# EAGLE schematic attiniest85-batty-shield-mk-2.0 (EAGLE 6.5.0)
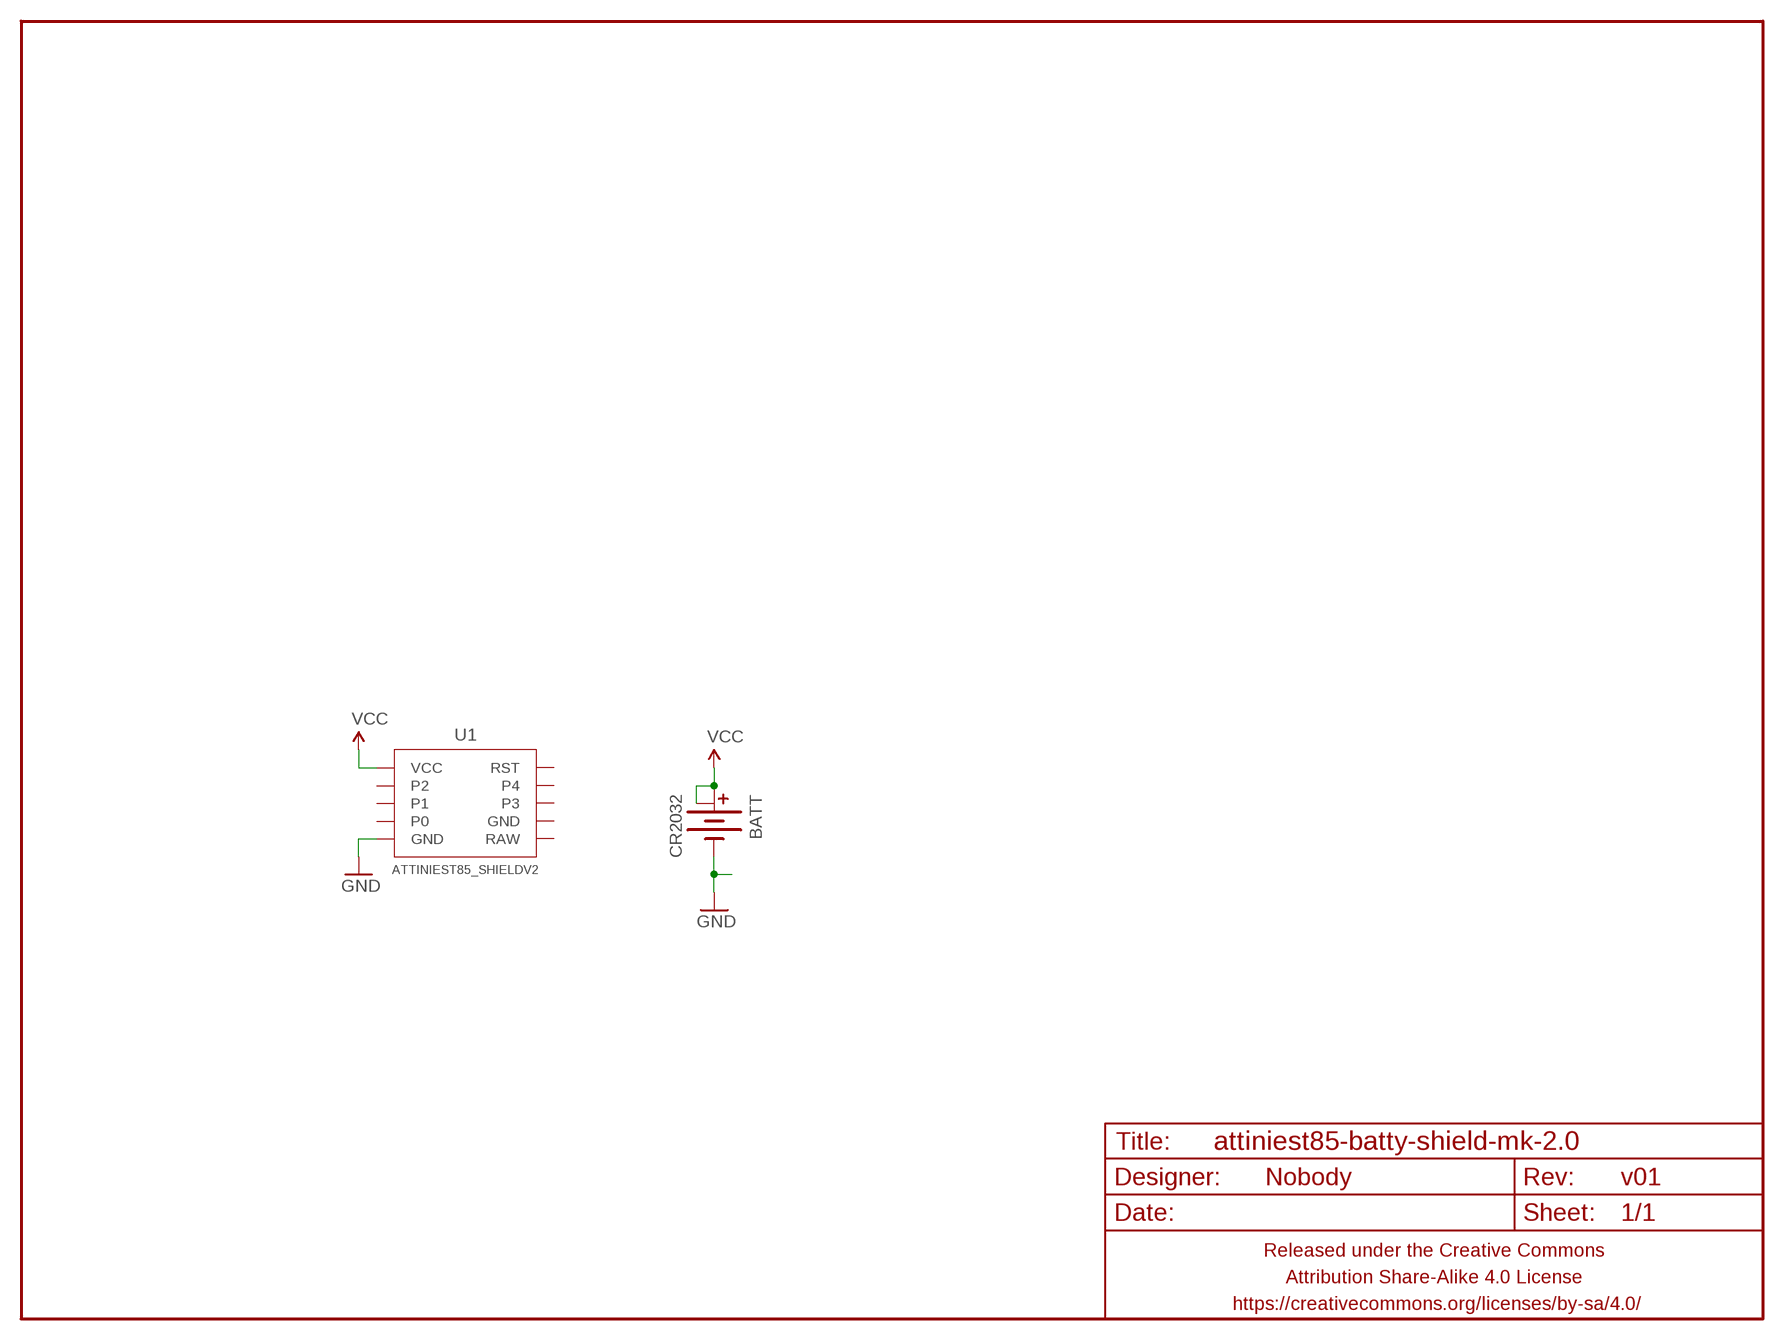
[diagram p0: schematic, sheet 1]

## Parts
BATT  CR2032  BATTERY-COINCR2032_SMD  [BATTCON_20MM_MINE]
FRAME1  FRAME-LETTERNO_PACKAGE  [DUMMY]
U1  ATTINIEST85_SHIELDV2  [ATTINIEST85_SHIELD_V2]

## Nets
GND: BATT.BOTTOM(-) U1.GND@2(GND)
VCC: BATT.TOP@1(+) BATT.TOP@2(+1) U1.VCC
Unconnected: U1.0 U1.1 U1.2 U1.3 U1.4 U1.GND@1(GND) U1.RAW U1.RST

## Library data of the parts
BATT = A_butts:BATTERY-COIN
FRAME1 = A_butts:FRAME-LETTER: Schematic Frame Standard 8.5x11 US Letter frame; DESIGNER: Nobody; VERSION: v01
U1 = A_butts:ATTINIEST85_SHIELD